# EAGLE design channelSelctorDriver (EAGLE 6.5.0)
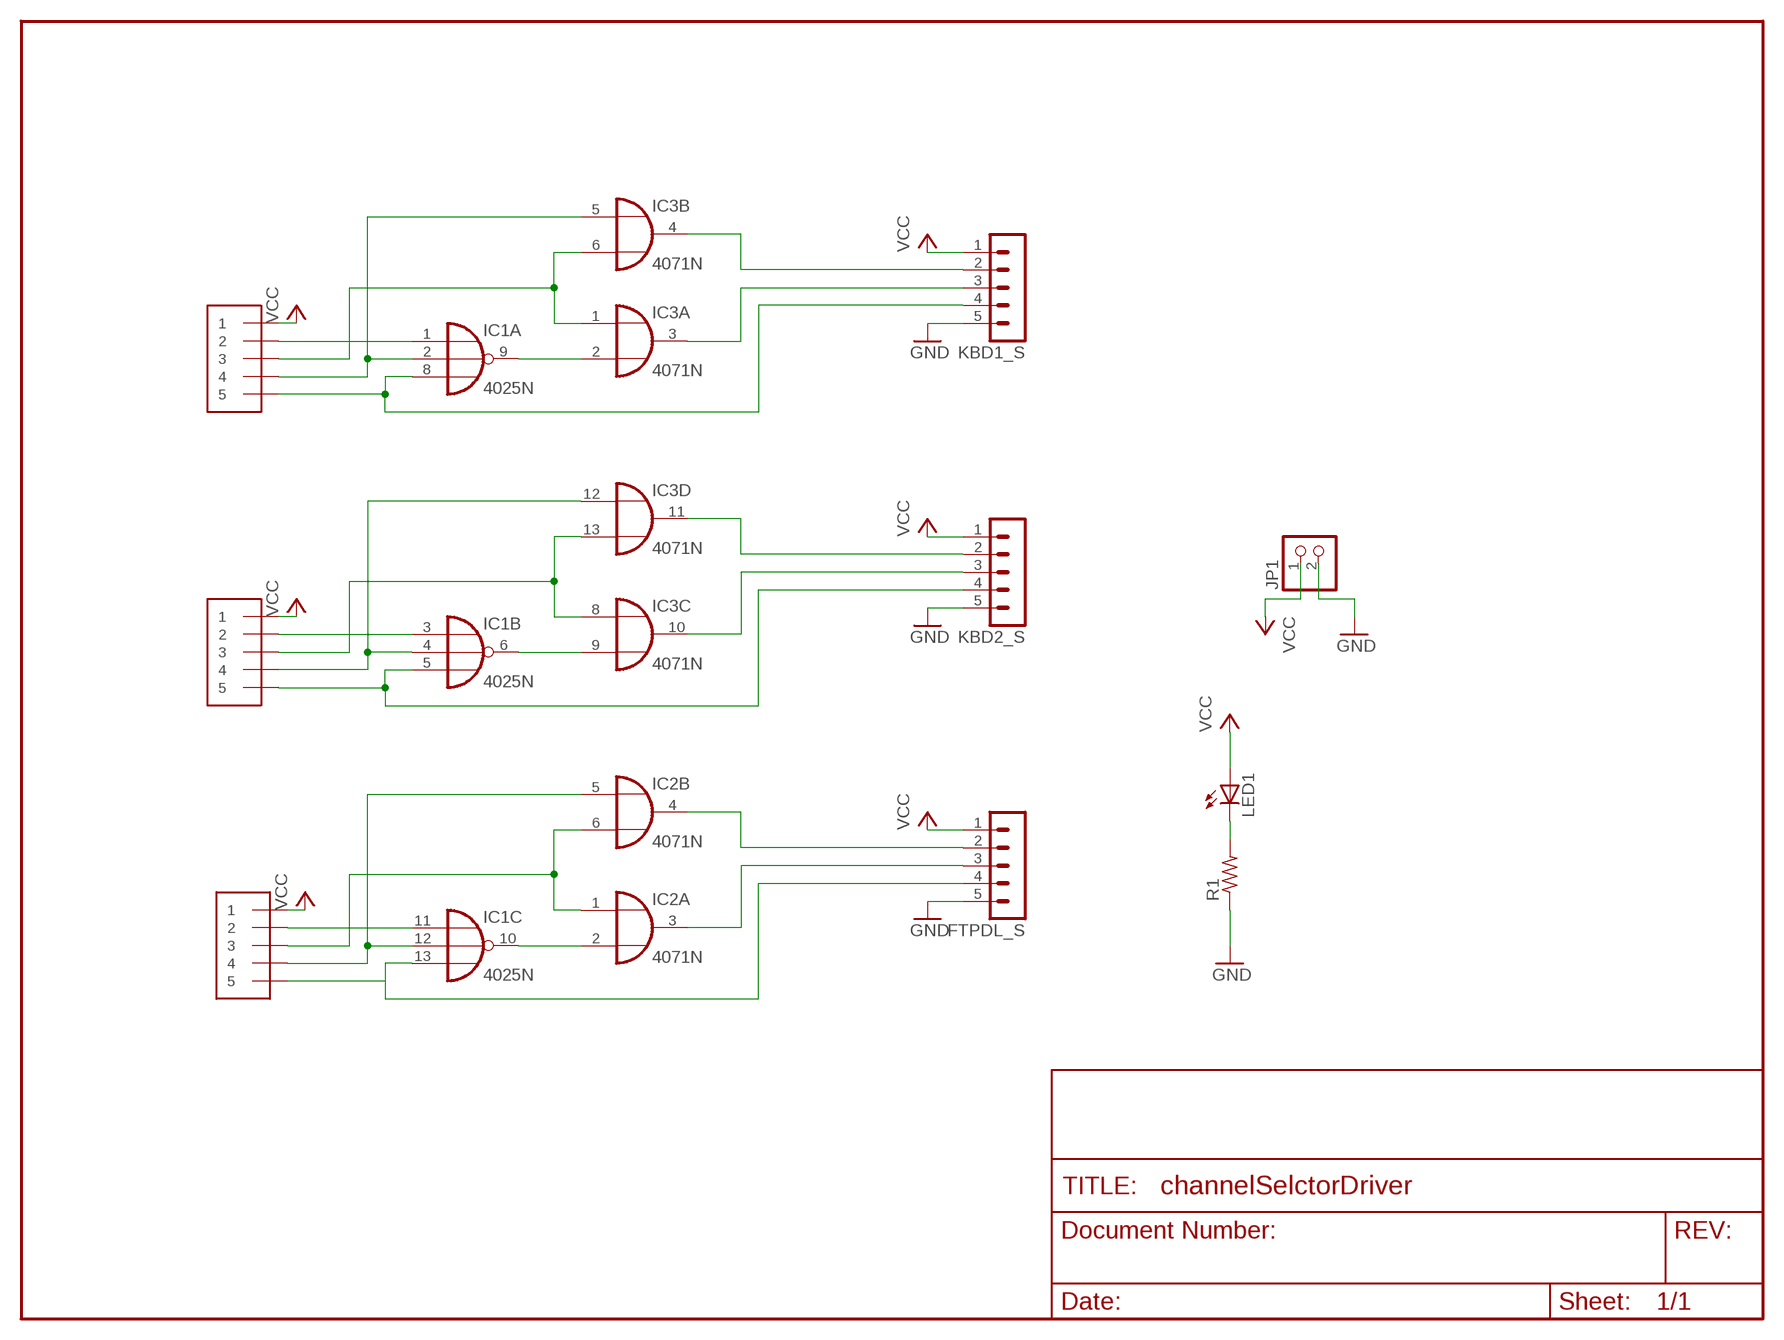
[diagram p0: schematic, sheet 1]

## Parts
FTPDL_S  MA05-1  [MA05-1]
IC1  4025N  [DIL14]
IC2  4071N  [DIL14]
IC3  4071N  [DIL14]
JP1  PINHD-1X2  [1X02]
KBD1_C  1X5  [1X05-3.5MM]
KBD1_S  MA05-1  [MA05-1]
KBD2_C  1X5  [1X05-3.5MM]
KBD2_S  MA05-1  [MA05-1]
KBD3_C  1X5  [1X05-3.5MM]
LED1  LEDLSU260  [LSU260]
R1  R-US_0204/7  [0204/7]

## Nets
GND: FTPDL_S.5 JP1.2 KBD1_S.5 KBD2_S.5 R1.1
N$1: IC1.9(A:O) IC3.2(A:I1)
N$2: IC1.6(B:O) IC3.9(C:I1)
N$3: IC1.10(C:O) IC2.2(A:I1)
N$4: IC1.5(B:I2) KBD2_C.5 KBD2_S.4
N$5: IC1.2(A:I1) IC3.5(B:I0) KBD1_C.4
N$6: IC1.12(C:I1) IC2.5(B:I0) KBD3_C.4
N$7: IC3.1(A:I0) IC3.6(B:I1) KBD1_C.3
N$8: IC3.4(B:O) KBD1_S.2
N$9: IC3.3(A:O) KBD1_S.3
N$10: IC1.1(A:I0) KBD1_C.2
N$11: IC1.11(C:I0) KBD3_C.2
N$12: LED1.K(C) R1.2
N$13: IC3.11(D:O) KBD2_S.2
N$14: IC3.10(C:O) KBD2_S.3
N$15: IC3.8(C:I0) IC3.13(D:I1) KBD2_C.3
N$17: IC1.4(B:I1) IC3.12(D:I0) KBD2_C.4
N$18: FTPDL_S.4 IC1.13(C:I2) KBD3_C.5
N$19: IC2.1(A:I0) IC2.6(B:I1) KBD3_C.3
N$20: FTPDL_S.2 IC2.4(B:O)
N$21: FTPDL_S.3 IC2.3(A:O)
N$23: IC1.8(A:I2) KBD1_C.5 KBD1_S.4
N$24: IC1.3(B:I0) KBD2_C.2
VCC: FTPDL_S.1 JP1.1 KBD1_C.1 KBD1_S.1 KBD2_C.1 KBD2_S.1 KBD3_C.1 LED1.A
Unconnected: IC2.8(C:I0) IC2.9(C:I1) IC2.10(C:O) IC2.11(D:O) IC2.12(D:I0) IC2.13(D:I1)

## Power pins joined to a net without a drawn wire
GND: IC1.7(P:VSS) IC2.7(P:VSS) IC3.7(P:VSS)
VCC: IC1.14(P:VDD) IC2.14(P:VDD) IC3.14(P:VDD)

## Library data of the parts
FTPDL_S KBD1_S KBD2_S = con-lstb:MA05-1: PIN HEADER; OC_FARNELL: unknown; OC_NEWARK: unknown
IC1 = 40xx:4025: Triple 3-input NOR
IC2 IC3 = 40xx:4071: Quad 2-input OR
JP1 = pinhead:PINHD-1X2: PIN HEADER
KBD1_C KBD2_C KBD3_C = adafruit:1X5
LED1 = led:LED: LED OSRAM: - CHIPLED LG R971, LG N971, LY N971, LG Q971, LY Q971, LO R971, LY R971 LH N974, LH R974 LS Q976, LO Q976, LY Q976 LO Q996 - Hyper CHIPLED LW Q18S LB Q993, LB Q99A, LB R99A - SideLED LS A670, LO A670, LY A670, LG A670, LP A670 LB A673, LV A673, LT A673, LW A673 LH A674 LY A675 LS A676, LA A676, LO A676, LY A676, LW A676 LS A679, LY A679, LG A679 - Hyper Micro SIDELED® LS Y876, LA Y876, LO Y876, LY Y876 LT Y87S - SmartLED LW L88C, LW L88S LB L89C, LB L89S, LG L890 LS L89K, LO L89K, LY L89K LS L896, LA L896, LO L896, LY L896 - TOPLED LS T670, LO T670, LY T670, LG T670, LP T670 LSG T670, LSP T670, LSY T670, LOP T670, LYG T670 LG T671, LOG T671, LSG T671 LB T673, LV T673, LT T673, LW T673 LH T674 LS T676, LA T676, LO T676, LY T676, LB T676, LH T676, LSB T676, LW T676 LB T67C, LV T67C, LT T67C, LS T67K, LO T67K, LY T67K, LW E67C LS E67B, LA E67B, LO E67B, LY E67B, LB E67C, LV E67C, LT E67C LW T67C LS T679, LY T679, LG T679 LS T770, LO T770, LY T770, LG T770, LP T770 LB T773, LV T773, LT T773, LW T773 LH T774 LS E675, LA E675, LY E675, LS T675 LS T776, LA T776, LO T776, LY T776, LB T776 LHGB T686 LT T68C, LB T68C - Hyper Mini TOPLED® LB M676 - Mini TOPLED Santana® LG M470 LS M47K, LO M47K, LY M47K Source: http://www.osram.convergy.de LUXEON: - LUMILED® LXK2-PW12-R00, LXK2-PW12-S00, LXK2-PW14-U00, LXK2-PW14-V00 LXK2-PM12-R00, LXK2-PM12-S00, LXK2-PM14-U00 LXK2-PE12-Q00, LXK2-PE12-R00, LXK2-PE12-S00, LXK2-PE14-T00, LXK2-PE14-U00 LXK2-PB12-K00, LXK2-PB12-L00, LXK2-PB12-M00, LXK2-PB14-N00, LXK2-PB14-P00, LXK2-PB14-Q00 LXK2-PR12-L00, LXK2-PR12-M00, LXK2-PR14-Q00, LXK2-PR14-R00 LXK2-PD12-Q00, LXK2-PD12-R00, LXK2-PD12-S00 LXK2-PH12-R00, LXK2-PH12-S00 LXK2-PL12-P00, LXK2-PL12-Q00, LXK2-PL12-R00 Source: www.luxeon.com KINGBRIGHT: KA-3528ASYC Source: www.kingbright.com
R1 = resistor:R-US_: RESISTOR, American symbol

## Board
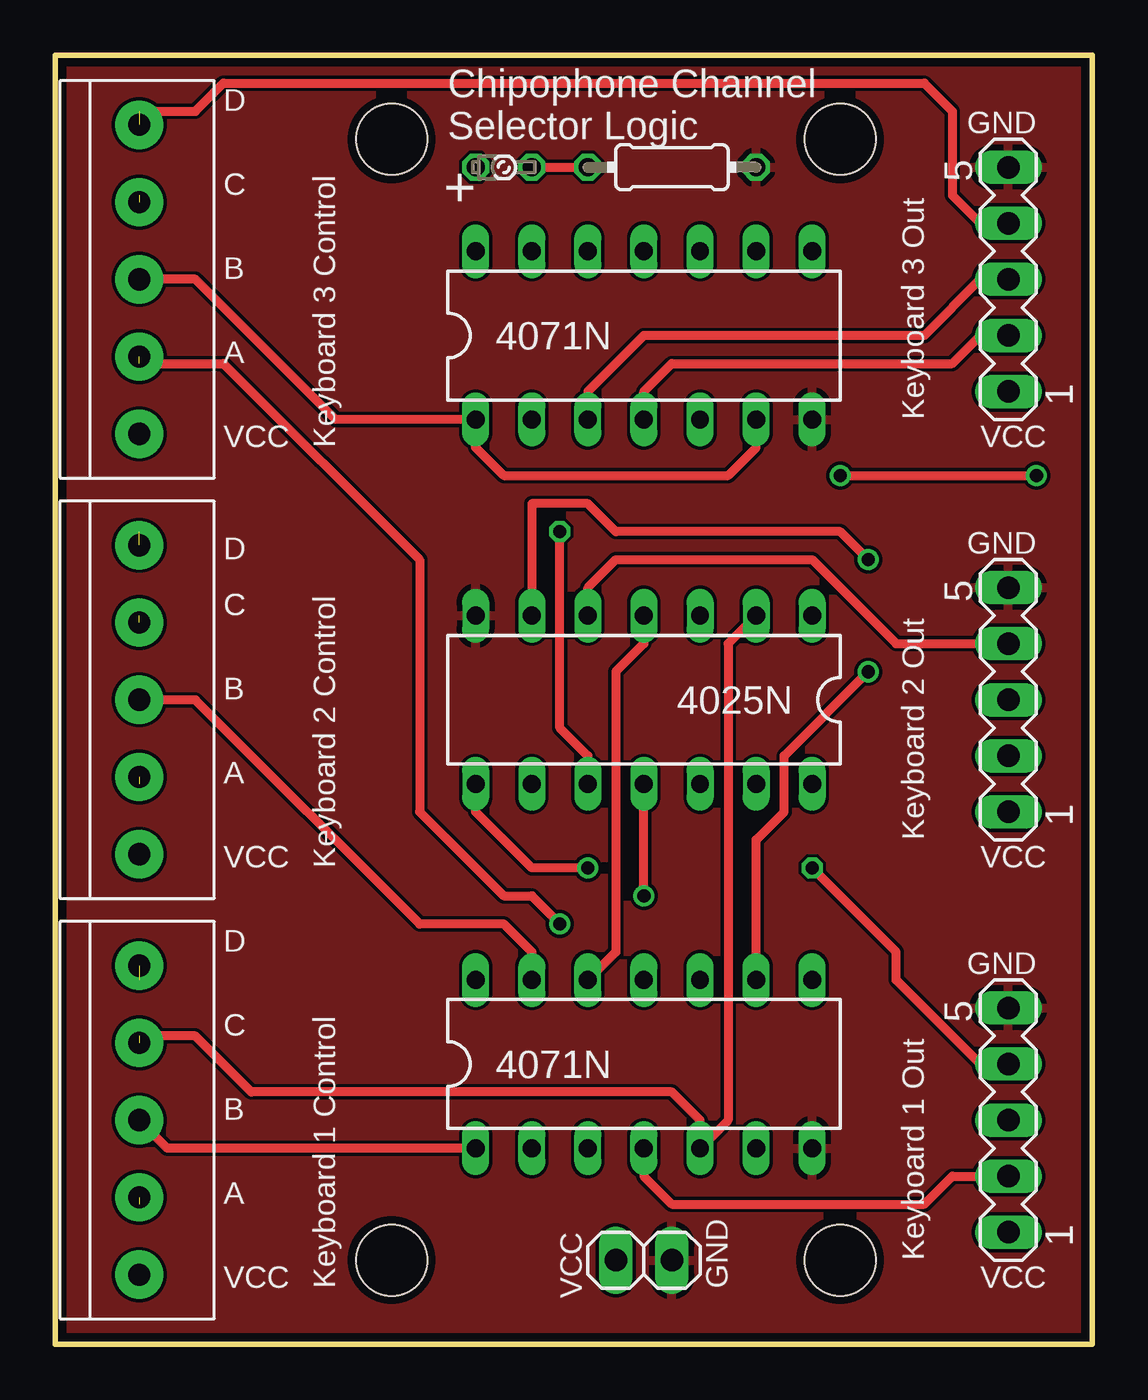
[diagram p1: board, top side]
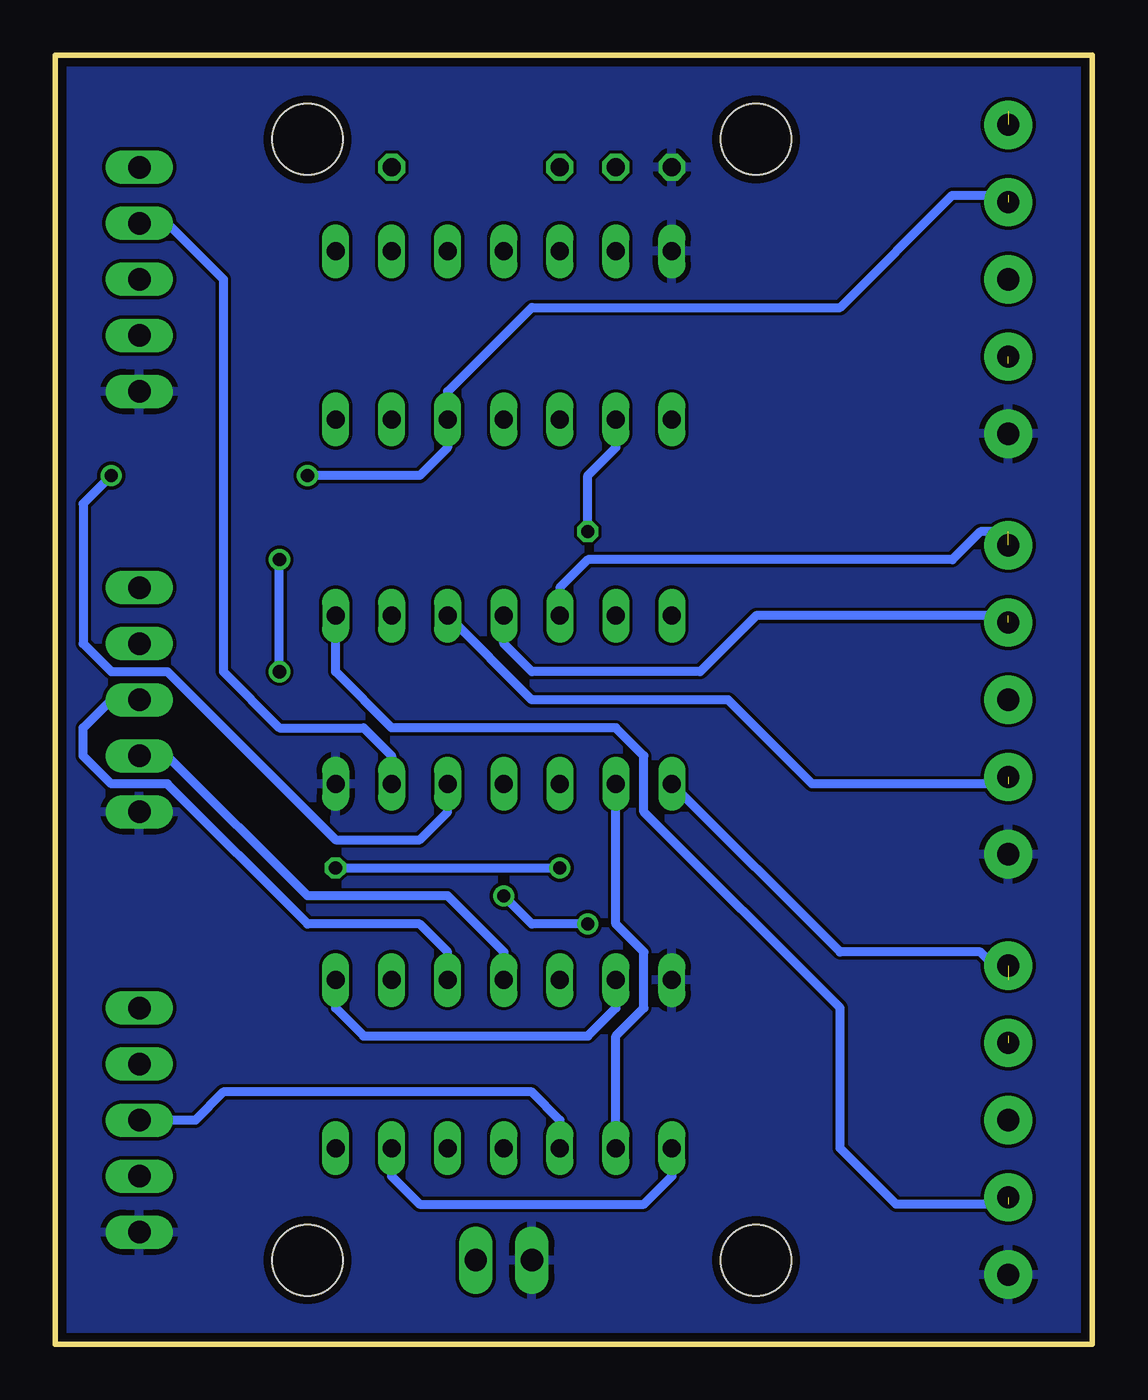
[diagram p2: board, bottom side, seen from below]

Size 46.99 x 58.42 mm. Coordinates in mm from the lower left corner, seen from the top.
Outline: 0,58.42 0,0 46.99,0 46.99,58.42 0,58.42
Copper layers (1*16): Top 0.0356mm / dielectric 1.5011mm / Bottom 0.0356mm
Design rules "OSHPark": minimum track width 6mil, minimum drill 13mil, track to track 6mil, track to pad 6mil, pad to pad 6mil, via to via 6mil, smd to smd 6mil, copper to edge 15mil, drill to drill 6mil, minimum pad ring 7mil, minimum via ring 7mil, stop-mask expansion 3mil, vias tented up to drill 0mil, thermal gap 10mil
Holes 3.2 mm at 15.24,54.61 15.24,3.81 35.56,3.81 35.56,54.61

### Footprints (pad centres in the part's own frame; a part is rotated, then mirrored left to right if it is on the bottom)
MA05-1 = drill 1.016 long: 1 -5.08,0; 2 -2.54,0; 3 0,0; 4 2.54,0; 5 5.08,0
DIL14 = drill 0.813 long: 1 -7.62,-3.81; 2 -5.08,-3.81; 3 -2.54,-3.81; 4 0,-3.81; 5 2.54,-3.81; 6 5.08,-3.81; 7 7.62,-3.81; 8 7.62,3.81; 9 5.08,3.81; 10 2.54,3.81; 11 0,3.81; 12 -2.54,3.81; 13 -5.08,3.81; 14 -7.62,3.81
1X02 = drill 1.016 long: 1 -1.27,0; 2 1.27,0
1X05-3.5MM = drill 1 pad 2.184: 1 7,0; 2 3.5,0; 3 0,0; 4 -3.5,0; 5 -7,0
LSU260 = drill 0.813 octagon: A -1.27,0; K 1.27,0
0204/7 = drill 0.813 octagon: 1 -3.81,0; 2 3.81,0

### Placement (x,y rotation side)
FTPDL_S  43.18,48.26 90 top
IC1  26.67,29.21 180 top
IC2  26.67,45.72 0 top
IC3  26.67,12.7 0 top
JP1  26.67,3.81 0 top
KBD1_C  3.81,10.16 270 top
KBD1_S  43.18,10.16 90 top
KBD2_C  3.81,29.21 270 top
KBD2_S  43.18,29.21 90 top
KBD3_C  3.81,48.26 270 top
LED1  20.32,53.34 0 top
R1  27.94,53.34 180 top

### Tracks (layer width: path | path; a pad name or v marks a point on that pad's centre or on a via)
GND
  pour Top: 0,0 0,58.42 46.99,58.42 46.99,0
N$1
  Bottom 0.406: IC3.2 21.59,13.97 20.32,15.24 20.32,17.78 21.59,19.05 IC1.9
N$2  (via drill 0.6)
  Top 0.406: IC3.9 31.75,22.86 33.02,24.13 33.02,26.67 v36.83,30.48 | v36.83,35.56 35.56,36.83 25.4,36.83 24.13,38.1 21.59,38.1 IC1.6
  Bottom 0.406: v36.83,30.48 v36.83,35.56
N$3  (via drill 0.6)
  Top 0.406: IC1.10 24.13,26.67 22.86,27.94 v22.86,36.83
  Bottom 0.406: v22.86,36.83 22.86,39.37 21.59,40.64 IC2.2
N$4  (1 unrouted)
  Top 0.406: IC1.5 24.13,34.29 25.4,35.56 34.29,35.56 38.1,31.75 KBD2_S.4
  Bottom 0.406: 3.81,36.83 5.08,36.83 6.35,35.56 22.86,35.56 24.13,34.29 IC1.5
N$5  (1 unrouted)
  Top 0.406: IC1.2 30.48,31.75 30.48,10.16 IC3.5 29.21,10.16 27.94,11.43 8.89,11.43 6.35,13.97 3.81,13.97
N$6  (via drill 0.6)  (1 unrouted)
  Top 0.406: v35.56,39.37 v44.45,39.37
  Bottom 0.406: 3.81,52.07 6.35,52.07 11.43,46.99 25.4,46.99 29.21,43.18 IC2.5 29.21,40.64 30.48,39.37 v35.56,39.37 | v44.45,39.37 45.72,38.1 45.72,31.75 44.45,30.48 41.91,30.48 34.29,22.86 30.48,22.86 29.21,24.13 IC1.12
N$7
  Top 0.406: IC3.1 5.08,8.89 KBD1_C.3
  Bottom 0.406: IC3.6 31.75,7.62 30.48,6.35 20.32,6.35 19.05,7.62 IC3.1
N$8
  Top 0.406: IC3.4 26.67,7.62 27.94,6.35 39.37,6.35 40.64,7.62 KBD1_S.2
N$9
  Bottom 0.406: IC3.3 24.13,10.16 25.4,11.43 39.37,11.43 40.64,10.16 KBD1_S.3
N$10  (1 unrouted)
  Bottom 0.406: 3.81,6.35 8.89,6.35 11.43,8.89 11.43,15.24 20.32,24.13 20.32,26.67 21.59,27.94 31.75,27.94 34.29,30.48 IC1.1
N$11  (via drill 0.6)  (1 unrouted)
  Top 0.406: 3.81,44.45 7.62,44.45 16.51,35.56 16.51,24.13 20.32,20.32 21.59,20.32 v22.86,19.05 | v26.67,20.32 IC1.11
  Bottom 0.406: v22.86,19.05 25.4,19.05 v26.67,20.32
N$12
  Top 0.406: LED1.K R1.2
N$13
  Bottom 0.406: IC3.11 26.67,17.78 29.21,20.32 35.56,20.32 41.91,26.67 KBD2_S.2
N$14
  Bottom 0.406: IC3.10 29.21,17.78 30.48,19.05 35.56,19.05 41.91,25.4 44.45,25.4 45.72,26.67 45.72,27.94 44.45,29.21 KBD2_S.3
N$15
  Top 0.406: IC3.13 21.59,17.78 20.32,19.05 16.51,19.05 6.35,29.21 KBD2_C.3
  Bottom 0.406: IC3.8 34.29,15.24 33.02,13.97 22.86,13.97 21.59,15.24 IC3.13
N$17  (1 unrouted)
  Top 0.406: IC1.4 26.67,31.75 25.4,30.48 25.4,17.78 IC3.12
  Bottom 0.406: 3.81,33.02 15.24,33.02 17.78,30.48 25.4,30.48 26.67,31.75 IC1.4
N$18  (1 unrouted)
  Top 0.406: 3.81,55.88 6.35,55.88 7.62,57.15 39.37,57.15 40.64,55.88 40.64,52.07 41.91,50.8 FTPDL_S.4
  Bottom 0.406: FTPDL_S.4 41.91,50.8 39.37,48.26 39.37,30.48 36.83,27.94 33.02,27.94 31.75,26.67 IC1.13
N$19
  Top 0.406: IC2.6 31.75,40.64 30.48,39.37 20.32,39.37 19.05,40.64 IC2.1 12.7,41.91 6.35,48.26 KBD3_C.3
N$20
  Top 0.406: IC2.4 26.67,43.18 27.94,44.45 40.64,44.45 41.91,45.72 FTPDL_S.2
N$21
  Top 0.406: FTPDL_S.3 41.91,48.26 39.37,45.72 26.67,45.72 24.13,43.18 IC2.3
N$23  (via drill 0.6)  (1 unrouted)
  Top 0.406: KBD1_S.4 41.91,12.7 38.1,16.51 38.1,17.78 v34.29,21.59 | v24.13,21.59 21.59,21.59 19.05,24.13 IC1.8
  Bottom 0.406: 3.81,16.51 5.08,17.78 11.43,17.78 IC1.8 | v34.29,21.59 v24.13,21.59
N$24  (1 unrouted)
  Bottom 0.406: 3.81,25.4 12.7,25.4 16.51,29.21 25.4,29.21 IC1.3
VCC
  pour Bottom: 0,0 0,58.42 46.99,58.42 46.99,0

### Text on the board
tPlace: D | + | C | B | A | VCC | D | C | B | A | VCC | D | C | B | A | VCC
tNames: GND | Chipophone Channel / Selector Logic | Keyboard 3 Out | Keyboard 3 Control | VCC | GND | Keyboard 2 Out | Keyboard 2 Control | VCC | GND | VCC | Keyboard 1 Out | Keyboard 1 Control | GND | VCC